# Altium schematic sheet CH340N4T-R0.SchDoc
size 127 x 114 mm; SheetNumber: 0; SheetTotal: 0
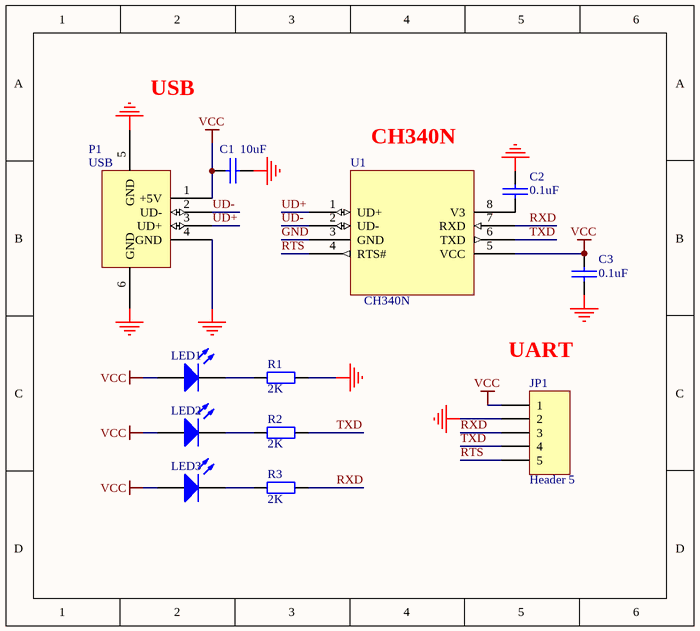
[diagram p0: CH340N4T-R0.SchDoc]

## Parts
C1  10uF  [3216_C]
C2  0.1uF  [0603_C]
C3  0.1uF  [0603_C]
JP1  Header 5  [SIP5-2.54mm]
LED1  PWR  [0603+]  (value not drawn)
LED2  TXD  [0603+]  (value not drawn)
LED3  RXD  [0603+]  (value not drawn)
P1  USB  [USBAM]
R1  2K  [0603]
R2  2K  [0603]
R3  2K  [0603]
U1  CH340N  [SOP8]

## Nets
GND: C1.2 C2.2 C3.1 JP1.2 P1.4(GND) P1.5(GND) P1.6(GND) R1.2 U1.3(GND)
VCC: C1.1 C3.2 JP1.1 LED1.1(A) LED2.1(A) LED3.1(A) P1.1(+5V) U1.5(VCC)
RTS: JP1.5 U1.4(RTS#)
RXD: JP1.3 R3.2 U1.7(RXD)
TXD: JP1.4 R2.2 U1.6(TXD)
UD+: P1.3(UD+) U1.1(UD+)
UD-: P1.2(UD-) U1.2(UD-)
NetC2_1: C2.1 U1.8(V3)
NetLED1_2: LED1.2(K) R1.1
NetLED2_2: LED2.2(K) R2.1
NetLED3_2: LED3.2(K) R3.1

## Notes on the sheet
- USB
- CH340N
- UART

## Library data of the parts
C1-C3 = CAP: Capacitor
JP1 = Header 5: Header, 5-Pin
LED1-LED3 = LED2: Typical RED, GREEN, YELLOW, AMBER GaAs LED
  LED1: PackageDocument: Feb-2002
R1-R3 = Res2: Resistor
U1 = CH340N: USB to TTL Serial / UART